# EAGLE design quadcopter (EAGLE 8.1.1)
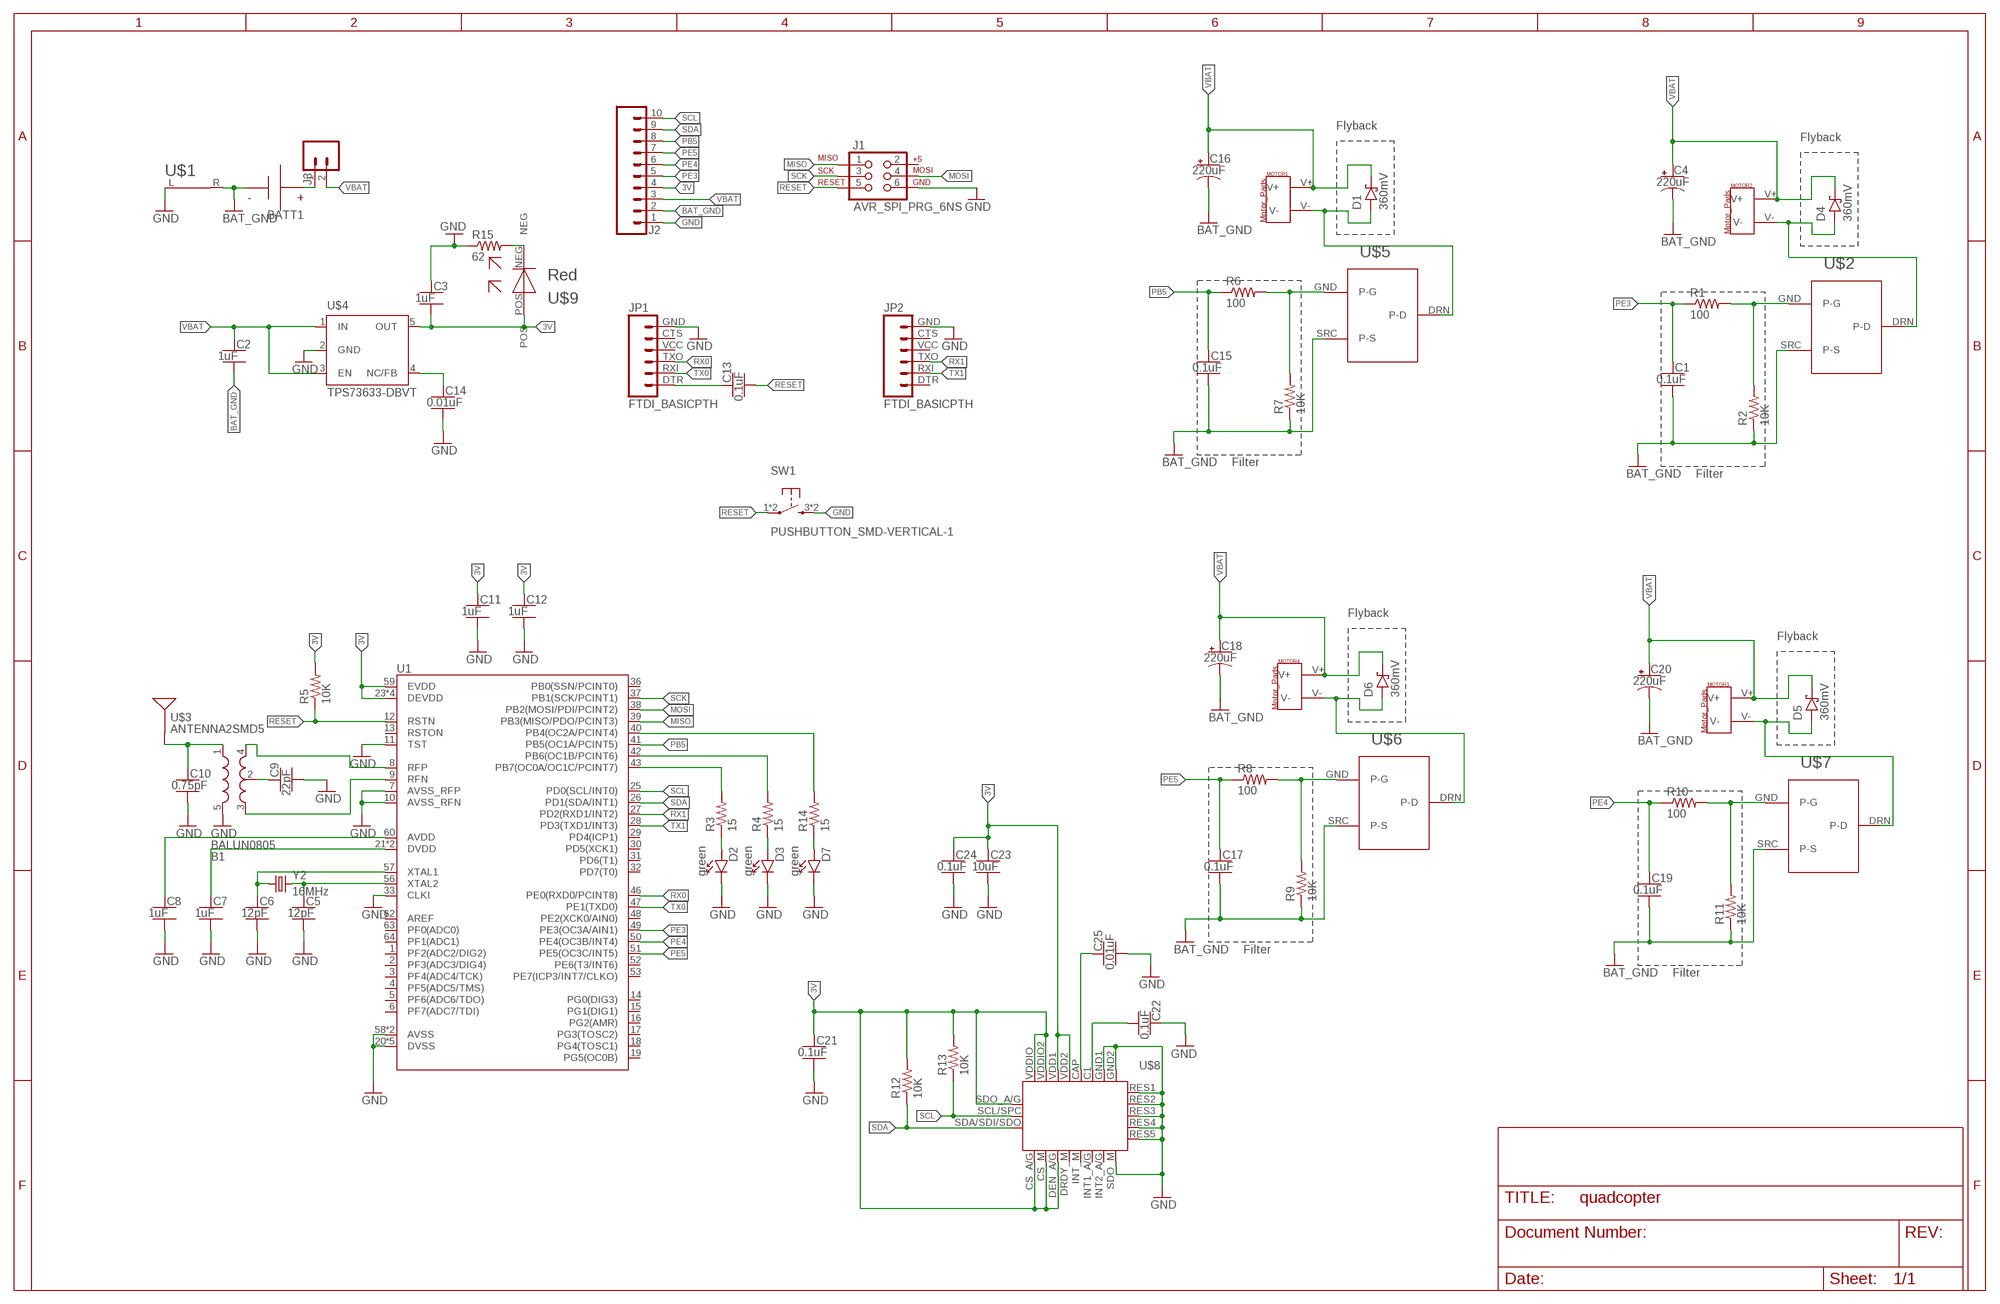
[diagram p0: schematic, sheet 1]

## Parts
B1  BALUN0805  [BALUN]
BATT1  BATTERY-HUBSAN-W/HOLDER  [BATTERY-W/HOLDER-380MAH-HUBSAN]
C1  0.1uF  CAPACITOR-NP_SMD-2012-0805_CERAMIC-0.1UF  [CAPC2012X140_HS]
C2  1uF  CAPACITOR-NP_SMD-2012-0805_CERAMIC-1UF  [CAPC2012X140_HS]
C3  1uF  CAPACITOR-NP_SMD-2012-0805_CERAMIC-1UF  [CAPC2012X140_HS]
C4  220uF  CAPACITOR-POL_SMD-7043-D_TANTALUM-220UF  [CAPMP7343X310_HS]
C5  12pF  CAPACITOR-NP_SMD-2012-0805_CERAMIC-12PF  [CAPC2012X140_HS]
C6  12pF  CAPACITOR-NP_SMD-2012-0805_CERAMIC-12PF  [CAPC2012X140_HS]
C7  1uF  CAPACITOR-NP_SMD-2012-0805_CERAMIC-1UF  [CAPC2012X140_HS]
C8  1uF  CAPACITOR-NP_SMD-2012-0805_CERAMIC-1UF  [CAPC2012X140_HS]
C9  22pF  CAPACITOR-NP_SMD-2012-0805_CERAMIC-22PF  [CAPC2012X140_HS]
C10  0.75pF  CAPACITOR-NP_SMD-2012-0805_CERAMIC-0.75PF  [CAPC2012X140_HS]
C11  1uF  CAPACITOR-NP_SMD-2012-0805_CERAMIC-1UF  [CAPC2012X140_HS]
C12  1uF  CAPACITOR-NP_SMD-2012-0805_CERAMIC-1UF  [CAPC2012X140_HS]
C13  0.1uF  CAPACITOR-NP_SMD-2012-0805_CERAMIC-0.1UF  [CAPC2012X140_HS]
C14  0.01uF  CAPACITOR-NP_SMD-2012-0805_CERAMIC-0.01UF  [CAPC2012X140_HS]
C15  0.1uF  CAPACITOR-NP_SMD-2012-0805_CERAMIC-0.1UF  [CAPC2012X140_HS]
C16  220uF  CAPACITOR-POL_SMD-7043-D_TANTALUM-220UF  [CAPMP7343X310_HS]
C17  0.1uF  CAPACITOR-NP_SMD-2012-0805_CERAMIC-0.1UF  [CAPC2012X140_HS]
C18  220uF  CAPACITOR-POL_SMD-7043-D_TANTALUM-220UF  [CAPMP7343X310_HS]
C19  0.1uF  CAPACITOR-NP_SMD-2012-0805_CERAMIC-0.1UF  [CAPC2012X140_HS]
C20  220uF  CAPACITOR-POL_SMD-7043-D_TANTALUM-220UF  [CAPMP7343X310_HS]
C21  0.1uF  CAPACITOR-NP_SMD-2012-0805_CERAMIC-0.1UF  [CAPC2012X140_HS]
C22  0.1uF  CAPACITOR-NP_SMD-2012-0805_CERAMIC-0.1UF  [CAPC2012X140_HS]
C23  10uF  CAPACITOR-NP_SMD-2012-0805_CERAMIC-10UF  [CAPC2012X140_HS]
C24  0.1uF  CAPACITOR-NP_SMD-2012-0805_CERAMIC-0.1UF  [CAPC2012X140_HS]
C25  0.01uF  CAPACITOR-NP_SMD-2012-0805_CERAMIC-0.01UF  [CAPC2012X140_HS]
D1  360mV  DIODE-SCHOTTKY_SMD-SOD123-360MV  [SOD3716X135_HS]
D2  green  DIODE-LED_SMD-2012-0805-GREEN  [LEDSC125X200X120-2_HS]
D3  green  DIODE-LED_SMD-2012-0805-GREEN  [LEDSC125X200X120-2_HS]
D4  360mV  DIODE-SCHOTTKY_SMD-SOD123-360MV  [SOD3716X135_HS]
D5  360mV  DIODE-SCHOTTKY_SMD-SOD123-360MV  [SOD3716X135_HS]
D6  360mV  DIODE-SCHOTTKY_SMD-SOD123-360MV  [SOD3716X135_HS]
D7  green  DIODE-LED_SMD-2012-0805-GREEN  [LEDSC125X200X120-2_HS]
J1  AVR_SPI_PRG_6NS  [2X3-NS]
J2  SIP-10_TH-254X10  [HDRV10W63P254_10X1_2540X254H838_HS]
J3  MALE_HEADER_2POS-2X1-0.1IN  [MALE_HEADER_2X1_0.1IN]
JP1  FTDI_BASICPTH  [FTDI_BASIC]
JP2  FTDI_BASICPTH  [FTDI_BASIC]
MOTOR1  MOTOR_PADS  [MOTOR_PADS]
MOTOR2  MOTOR_PADS  [MOTOR_PADS]
MOTOR3  MOTOR_PADS  [MOTOR_PADS]
MOTOR4  MOTOR_PADS  [MOTOR_PADS]
R1  100  RESISTOR_SMD-2012-0805-100  [RESC2012X60_HS]
R2  10K  RESISTOR_SMD-2012-0805-10K  [RESC2012X60_HS]
R3  15  RESISTOR_SMD-2012-0805-15  [RESC2012X60_HS]
R4  15  RESISTOR_SMD-2012-0805-15  [RESC2012X60_HS]
R5  10K  RESISTOR_SMD-2012-0805-10K  [RESC2012X60_HS]
R6  100  RESISTOR_SMD-2012-0805-100  [RESC2012X60_HS]
R7  10K  RESISTOR_SMD-2012-0805-10K  [RESC2012X60_HS]
R8  100  RESISTOR_SMD-2012-0805-100  [RESC2012X60_HS]
R9  10K  RESISTOR_SMD-2012-0805-10K  [RESC2012X60_HS]
R10  100  RESISTOR_SMD-2012-0805-100  [RESC2012X60_HS]
R11  10K  RESISTOR_SMD-2012-0805-10K  [RESC2012X60_HS]
R12  10K  RESISTOR_SMD-2012-0805-10K  [RESC2012X60_HS]
R13  10K  RESISTOR_SMD-2012-0805-10K  [RESC2012X60_HS]
R14  15  RESISTOR_SMD-2012-0805-15  [RESC2012X60_HS]
R15  62  RESISTOR_SMD-2012-0805-62  [RESC2012X60_HS]
SW1  PUSHBUTTON_SMD-VERTICAL-1  [TE_FSM8JSMA_HS]
U1  ATMEGA128RFA1  [QFN-64]
U$1  NET_BRIDGE  [NET_BRIDGE]
U$2  MOSFET_20V  [MOSFET_20V]
U$3  ANTENNA2SMD5  [ANTENNA-CHIP5]
U$4  TPS73633-DBVT  [SOT23-DBV]
U$5  MOSFET_20V  [MOSFET_20V]
U$6  MOSFET_20V  [MOSFET_20V]
U$7  MOSFET_20V  [MOSFET_20V]
U$8  IMU_9AXIS  [IMU_9AXIS]
U$9  Red  RED_LED_0805  [RED_LED_0805]
Y2  16MHz  CRYSTAL5X3  [CRYSTAL-SMD-5X3]

## Nets
3V: C3.2 C11.1 C12.1 C21.1 C23.1 C24.1 J2.4 R5.2 R12.2 R13.2 U1.23(DEVDD) U1.34(DEVDD) U1.44(DEVDD) U1.54(DEVDD) U1.59(EVDD) U$4.5(OUT) U$8.CS_A/G U$8.CS_M U$8.DEN_A/G U$8.SDO_A/G U$8.VDD1 U$8.VDD2 U$8.VDDIO2 U$8.VDDIO(VDDIO1) U$9.POS
BAT_GND [HIGHCURRENT]: BATT1.-(N) C1.2 C2.2 C4.2(-) C15.2 C16.2(-) C17.2 C18.2(-) C19.2 C20.2(-) J2.2 R2.1 R7.1 R9.1 R11.1 U$1.R U$2.SRC(P-S) U$5.SRC(P-S) U$6.SRC(P-S) U$7.SRC(P-S)
FILTERED1 [HIGHCURRENT]: R6.2 R7.2 U$5.GND(P-G)
FILTERED2 [HIGHCURRENT]: R1.2 R2.2 U$2.GND(P-G)
FILTERED3 [HIGHCURRENT]: R10.2 R11.2 U$7.GND(P-G)
FILTERED4 [HIGHCURRENT]: R8.2 R9.2 U$6.GND(P-G)
FLYBACK1 [HIGHCURRENT]: D1.A MOTOR1.V- U$5.DRN(P-D)
FLYBACK2 [HIGHCURRENT]: D4.A MOTOR2.V- U$2.DRN(P-D)
FLYBACK3 [HIGHCURRENT]: D5.A MOTOR3.V- U$7.DRN(P-D)
FLYBACK4 [HIGHCURRENT]: D6.A MOTOR4.V- U$6.DRN(P-D)
GND: B1.5(GND) C3.1 C5.2 C6.2 C7.2 C8.2 C9.2 C10.2 C11.2 C12.2 C14.2 C21.2 C22.1 C23.2 C24.2 C25.2 D2.C D3.C D7.C J1.6 J2.1 JP1.GND JP2.GND R15.1 SW1.3 SW1.4 U1.7(AVSS_RFP) U1.10(AVSS_RFN) U1.11(TST) U1.20(DVSS) U1.24(DVSS) U1.33(CLKI) U1.35(DVSS) U1.45(DVSS) U1.55(DVSS) U1.58(AVSS) U1.61(AVSS) U$1.L U$4.2(GND) U$8.GND1 U$8.GND2 U$8.RES1 U$8.RES2 U$8.RES3 U$8.RES4 U$8.RES5 U$8.SDO_M
MISO: J1.1 U1.39(PB3(MISO/PDO/PCINT3))
MOSI: J1.4 U1.38(PB2(MOSI/PDI/PCINT2))
N$1: C14.1 U$4.4(NC/FB)
N$2: D7.A R14.1
N$3: D2.A R3.1
N$4: C5.1 U1.56(XTAL2) Y2.3
N$5: C6.1 U1.57(XTAL1) Y2.1
N$6: D3.A R4.1
N$7: C7.1 U1.21(DVDD) U1.22(DVDD)
N$8: C8.1 U1.60(AVDD)
N$9: B1.4(OUT1) U1.8(RFP)
N$10: B1.3(OUT2) U1.9(RFN)
N$11: B1.2(GND) C9.1
N$12 [RFSIG]: B1.1(IN) C10.1 U$3.FEED(SIGNAL)
N$13: C13.1 JP1.DTR
N$17: BATT1.+(P) J3.1
N$18: R15.2 U$9.NEG
N$20: C25.1 U$8.CAP
N$23: C22.2 U$8.C1
PB4: R14.2 U1.40(PB4(OC2A/PCINT4))
PB5: C15.1 J2.8 R6.1 U1.41(PB5(OC1A/PCINT5))
PB6: R4.2 U1.42(PB6(OC1B/PCINT6))
PB7: R3.2 U1.43(PB7(OC0A/OC1C/PCINT7))
PE3: C1.1 J2.5 R1.1 U1.49(PE3(OC3A/AIN1))
PE4: C19.1 J2.6 R10.1 U1.50(PE4(OC3B/INT4))
PE5: C17.1 J2.7 R8.1 U1.51(PE5(OC3C/INT5))
RESET: C13.2 J1.5 R5.1 SW1.1 SW1.2 U1.12(RSTN)
RX0: JP1.TXO U1.46(PE0(RXD0/PCINT8))
RX1: JP2.TXO U1.27(PD2(RXD1/INT2))
SCK: J1.3 U1.37(PB1(SCK/PCINT1))
SCL: J2.10 R13.1 U1.25(PD0(SCL/INT0)) U$8.SCL/SPC
SDA: J2.9 R12.1 U1.26(PD1(SDA/INT1)) U$8.SDA/SDI/SDO
TX0: JP1.RXI U1.47(PE1(TXD0))
TX1: JP2.RXI U1.28(PD3(TXD1/INT3))
VBAT [HIGHCURRENT]: C2.1 C4.1(+) C16.1(+) C18.1(+) C20.1(+) D1.C D4.C D5.C D6.C J2.3 J3.2 MOTOR1.V+ MOTOR2.V+ MOTOR3.V+ MOTOR4.V+ U$4.1(IN) U$4.3(EN)
Unconnected: J1.2 JP1.CTS JP1.VCC JP2.CTS JP2.DTR JP2.VCC U1.1(PF2(ADC2/DIG2)) U1.2(PF3(ADC3/DIG4)) U1.3(PF4(ADC4/TCK)) U1.4(PF5(ADC5/TMS)) U1.5(PF6(ADC6/TDO)) U1.6(PF7(ADC7/TDI)) U1.13(RSTON) U1.14(PG0(DIG3)) U1.15(PG1(DIG1)) U1.16(PG2(AMR)) U1.17(PG3(TOSC2)) U1.18(PG4(TOSC1)) U1.19(PG5(OC0B)) U1.29(PD4(ICP1)) U1.30(PD5(XCK1)) U1.31(PD6(T1)) U1.32(PD7(T0)) U1.36(PB0(SSN/PCINT0)) U1.48(PE2(XCK0/AIN0)) U1.52(PE6(T3/INT6)) U1.53(PE7(ICP3/INT7/CLKO)) U1.62(AREF) U1.63(PF0(ADC0)) U1.64(PF1(ADC1)) U$8.DRDY_M U$8.INT1_A/G U$8.INT2_A/G U$8.INT_M

## Notes on the sheet
- Flyback
- Flyback
- Filter
- Filter
- Flyback
- Flyback
- Filter
- Filter

## Library data of the parts
B1 = quadparts_prebuilt:BALUN: 0805 footprint balun- Ember 351/357; DATASHEET: http://katalog.we-online.de/pbs/datasheet/748421245.pdf; DIST: Digikey; DISTPN: 732-2230-6-ND; MFR: Wurth Electronics Inc; MPN: 748421245; PRICE: 2.63
BATT1 = quadparts_prebuilt:BATTERY; CREATOR: Swanson; DIST: AMAZON; DISTPN: http://www.amazon.com/dp/B00RROB6Q4?smid=AMNTPWSAB5H0S; MFR: HUBSAN; MPN: X4-H107C-8-in-1
C1 C13 C15 C17 C19 C21 C22 C24 = quadparts_prebuilt:CAPACITOR-NP_: Nonpolarized capacitor; DIST: Digikey; DISTPN: 490-1666-1-ND; MFR: Murata Electronics North America; MPN: GRM21BR71H104KA01L
C2 C3 C7 C8 C11 C12 = quadparts_prebuilt:CAPACITOR-NP_: Nonpolarized capacitor; DIST: Digikey; DISTPN: 490-4736-1-ND; MFR: Murata Electronics North America; MPN: GRM21BR71H105KA12L
C4 C16 C18 C20 = quadparts_prebuilt:CAPACITOR-POL_: Polarized capacitor; DIST: Digikey; DISTPN: 478-8912-1-ND; MFR: AVX Corporation; MPN: TAJD227K006RNJ
C5 C6 = quadparts_prebuilt:CAPACITOR-NP_: Nonpolarized capacitor; DIST: Digikey; DISTPN: 490-5531-1-ND; MFR: Murata Electronics North America; MPN: GRM21A5C2E120JW01D
C9 = quadparts_prebuilt:CAPACITOR-NP_: Nonpolarized capacitor; DIST: Digikey; DISTPN: 490-5534-1-ND; MFR: Murata Electronics North America; MPN: GRM21A5C2E220JW01D
C10 = quadparts_prebuilt:CAPACITOR-NP_: Nonpolarized capacitor; DIST: Digikey; DISTPN: 490-3585-1-ND; MFR: Murata Electronics North America; MPN: GQM2195C2AR75CB01D
C14 C25 = quadparts_prebuilt:CAPACITOR-NP_: Nonpolarized capacitor; DIST: Digikey; DISTPN: 490-8295-1-ND; MFR: Murata Electronics North America; MPN: GRM2195C1H103FA01D
C23 = quadparts_prebuilt:CAPACITOR-NP_: Nonpolarized capacitor; DIST: Digikey; DISTPN: 490-5523-1-ND; MFR: Murata Electronics North America; MPN: GRM21BR61E106KA73L
D1 D4-D6 = quadparts_prebuilt:DIODE-SCHOTTKY_: Schottky diode; DIST: Digikey; DISTPN: CRS08QMCT-ND; MFR: Toshiba Semiconductor and Storage; MPN: CRS08(TE85L,Q,M)
D2 D3 D7 = quadparts_prebuilt:DIODE-LED_: Light emitting diode; DIST: Digikey; DISTPN: 160-1179-1-ND; MFR: Lite-On Inc; MPN: LTST-C170GKT
J1 = quadparts_prebuilt:AVR_SPI_PRG_6: AVR ISP 6 Pin This is the reduced ISP connector for AVR programming. Common on Arduino. This footprint will take up less PCB space and can be used with a 10-pin to 6-pin adapter such as SKU: BOB-08508; DATASHEET: http://portal.fciconnect.com/Comergent//fci/drawing/67996.pdf; DIST: Digikey; DISTPN: 609-3234-ND; MFR: Amphenol FCI; MPN: 67997-206HLF; PRICE: 0.31
J2 = quadparts_prebuilt:SIP-10_: 10 pin single inline pin header, socket, or connector; DATASHEET: http://portal.fciconnect.com/Comergent//fci/drawing/68000.pdf; DIST: Digikey; DISTPN: 609-3250-ND; MFR: Amphenol FCI; MPN: 68000-110HLF; PRICE: 0.55
J3 = quadparts:MALE_HEADER_2POS: 2 pin single inline pin header, socket, or connector; CREATOR: SWANSON; DIST: Digikey; DISTPN: 3M9447-ND; MFR: 3M; MPN: 961102-6404-AR; REVIEWER: John Wu
JP1 JP2 = quadparts_prebuilt:FTDI_BASIC: FTDI Basic header with labels; DATASHEET: http://portal.fciconnect.com/Comergent//fci/drawing/68015.pdf; DIST: Digikey; DISTPN: 609-3327-ND; MFR: Amphenol FCI; MPN: 68016-406HLF; PRICE: 0.33
MOTOR1-MOTOR4 = quadparts_prebuilt:MOTOR_PADS; DIST: NA; DISTPN: NA; MFR: NA; MPN: NA
R1 R6 R8 R10 = quadparts_prebuilt:RESISTOR_: Resistor; DIST: Digikey; DISTPN: 311-100ARCT-ND; MFR: Yageo; MPN: RC0805JR-07100RL
R2 R5 R7 R9 R11-R13 = quadparts_prebuilt:RESISTOR_: Resistor; DIST: Digikey; DISTPN: 311-10KARCT-ND; MFR: Yageo; MPN: RC0805JR-0710KL
R3 R4 R14 = quadparts_prebuilt:RESISTOR_: Resistor; CREATOR: Joshua Crook; DIST: Digikey; DISTPN: 311-15ARCT-ND; MFR: Yageo; MPN: RC0805JR-0715RL; REVIEWER: John Wu
R15 = quadparts_prebuilt:RESISTOR_: Resistor; CREATOR: Joshua Crook; DIST: Digikey; DISTPN: 311-62ARCT-ND; MFR: Yageo; MPN: RC0805JR-0762RL; REVIEWER: John Wu
SW1 = quadparts_prebuilt:PUSHBUTTON_: Pushbutton with 2 pins shorting 1 to 2 and two extra mounting pins 3 & 4; DIST: Digikey; DISTPN: 450-1129-ND; MFR: TE Connectivity Alcoswitch Switches; MPN: FSM4JSMA
U1 = quadparts_prebuilt:ATMEGA128RFA1: ATmega128RFA1 8-bit AVR Microcontroller with Low Power 2.4GHz Transceiver for ZigBee and IEEE 802.15.4; CREATOR: Swanson; DATASHEET: http://www.atmel.com/Images/Atmel-8266-MCU_Wireless-ATmega128RFA1_Datasheet.pdf; DIST: Digikey; DISTPN: ATMEGA128RFA1-ZUR00DKR-ND; MFR: Atmel; MPN: ATMEGA128RFA1-ZUR00; PRICE: 10.21
U$1 = quadparts:NET_BRIDGE; CREATOR: Joshua Crook; REVIEWER: John Wu
U$2 U$5-U$7 = quadparts:MOSFET_20V; CREATOR: Alexander Orr; DIST: Digikey; DISTPN: SI2302CDS-T1-E3CT-ND; MFR: Vishay Siliconix; MPN: SI2302CDS-T1-E3; REVIEWER: John Wu
U$3 = quadparts_prebuilt:ANTENNA2: Chip antenna Single endded antenna. Common with smaller chip antennas. CHIP4 package is the GPS Chip Antenna SKU: GPS-08418. CHIP5 package is 2.4GHz chip antenna SKU: WRL-00144.; DATASHEET: http://www.linxtechnologies.com/resources/data-guides/ant-xxx-chp-x.pdf; DIST: Digikey; DISTPN: ANT-2.45-CHPCT-ND; MFR: Linx Technologies Inc.; MPN: ANT-2.45-CHP-T; PRICE: 3.16
U$4 = quadparts_prebuilt:TPS73633-DBVT; DATASHEET: http://www.ti.com/lit/ds/symlink/lp3985.pdf; DIST: Digikey; DISTPN: LP3985IM5X-3.0/NOPBCT-ND; MFR: Texas Instruments; MPN: LP3985IM5X-3.0/NOPB; PRICE: 0.59
U$8 = quadparts:IMU_9AXIS; CREATOR: Alex Orr; DIST: Digikey; DISTPN: 497-14946-1-ND; MFR: STMicroelectronics; MPN: LSM9DS1TR; REVIEWER: John Wu
U$9 = LEDs:RED_LED_0805; CREATOR: Alexander Orr; DIST: Digikey; DISTPN: 475-1278-1-ND; MFR: OSRAM Opto Semiconductors Inc.; MPN: LS R976-NR-1; REVIEWER: John Wu
Y2 = quadparts_prebuilt:CRYSTAL: Various standard crystals. Proven footprints.; DATASHEET: http://www.abracon.com/Resonators/abm3b.pdf; DIST: Digikey; DISTPN: 535-9122-1-ND; MFR: Abracon LLC; MPN: ABM3B-16.000MHZ-B2-T; PRICE: 0.68; PROD_ID: XTAL-08218

## Net classes
1 RFSIG: width 0.457 mm
2 HIGHCURRENT: width 0.457 mm

## Board
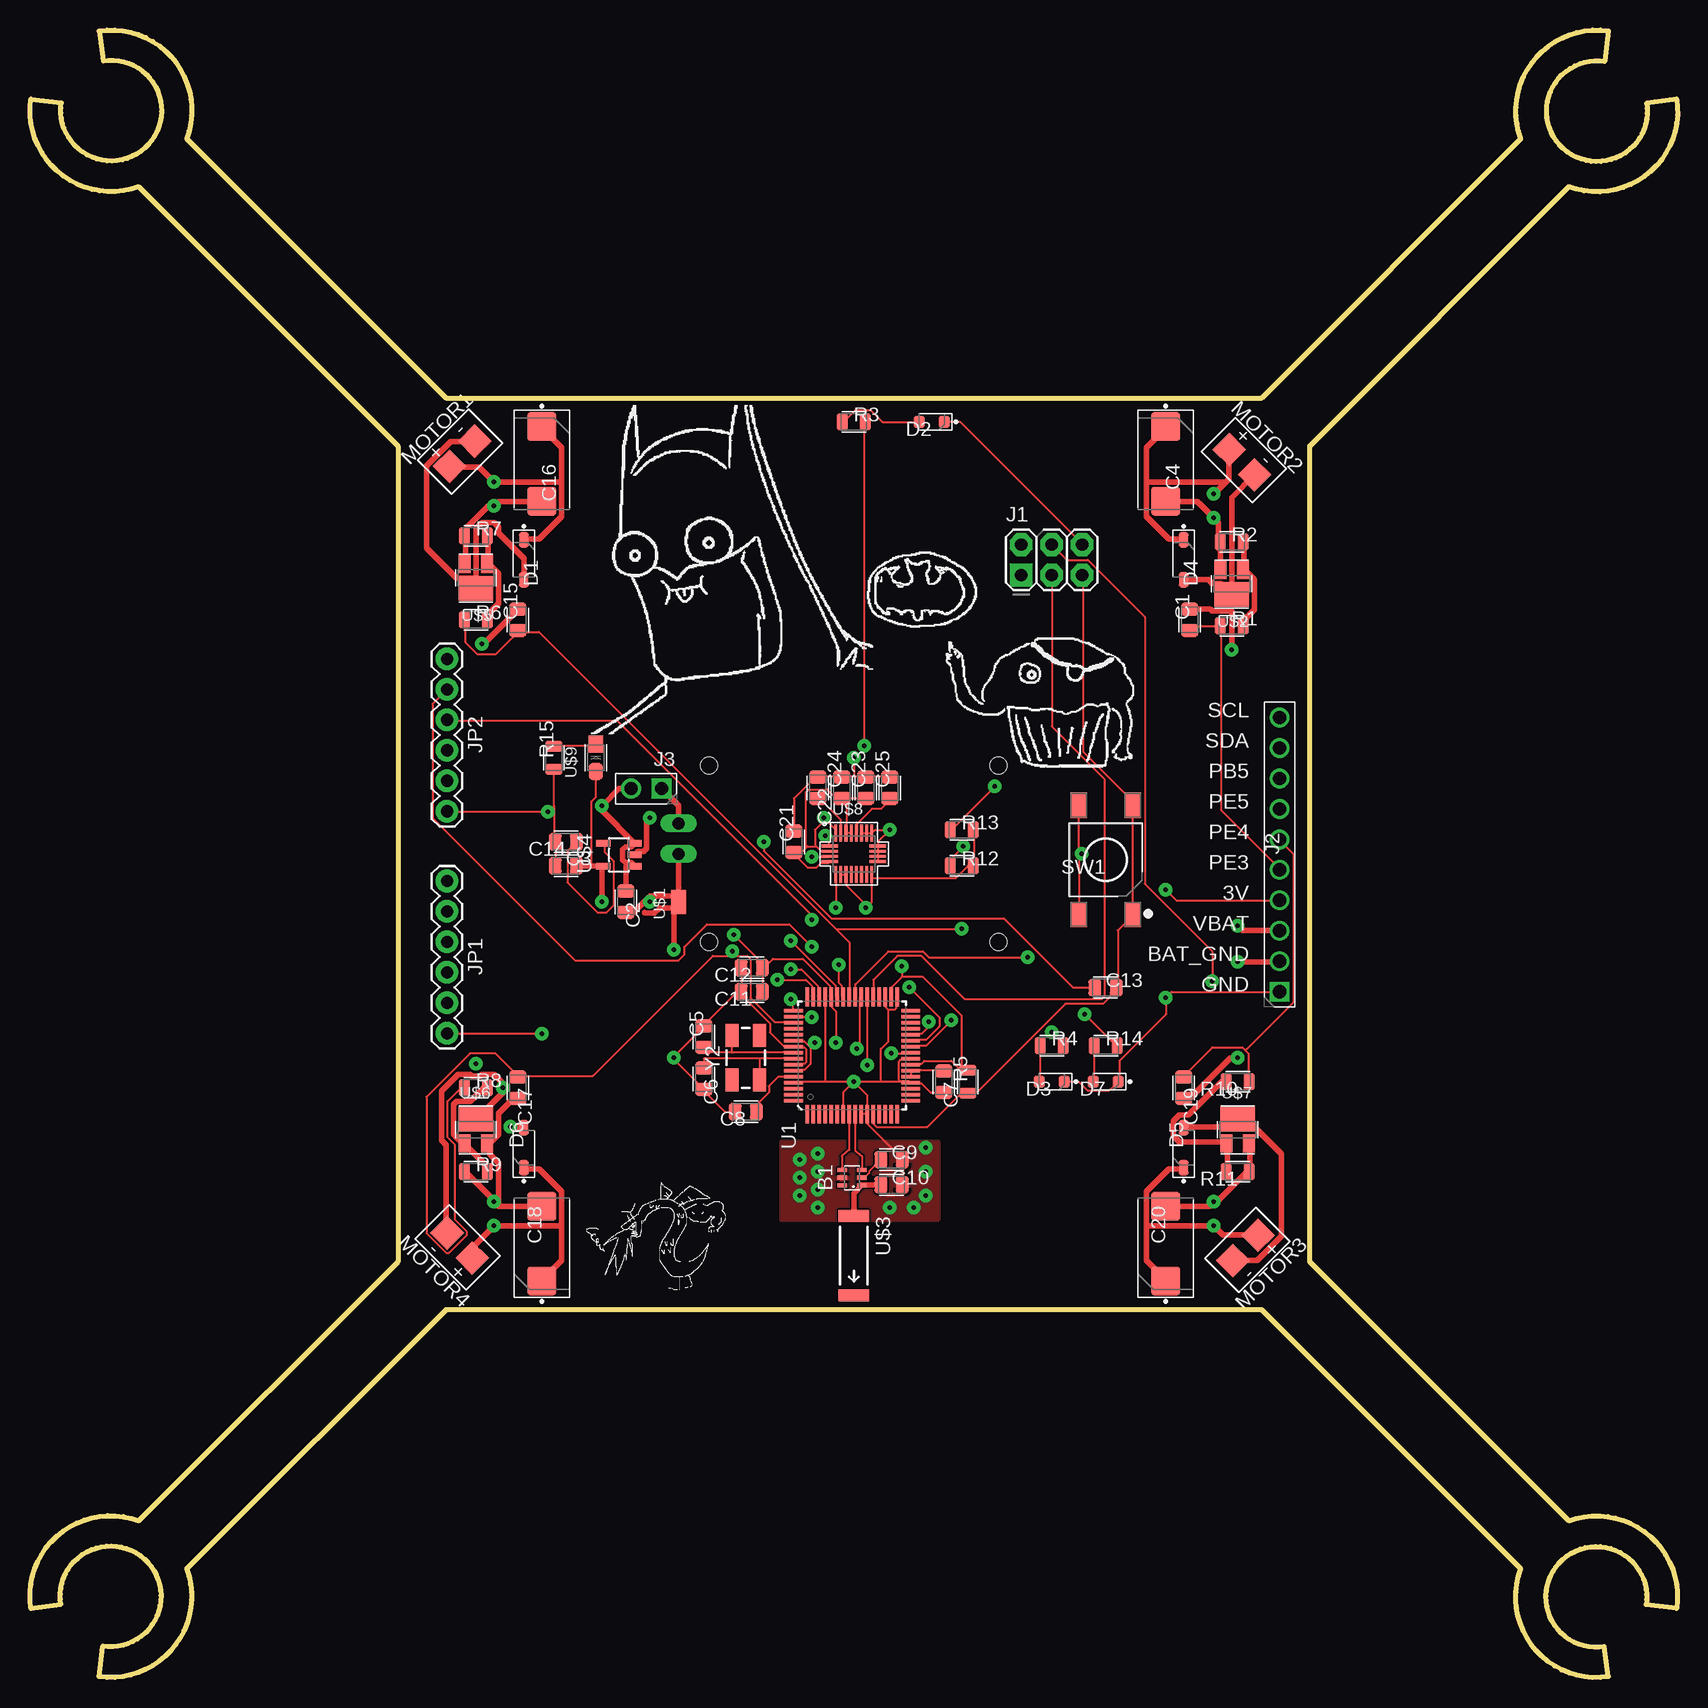
[diagram p1: board, top side]
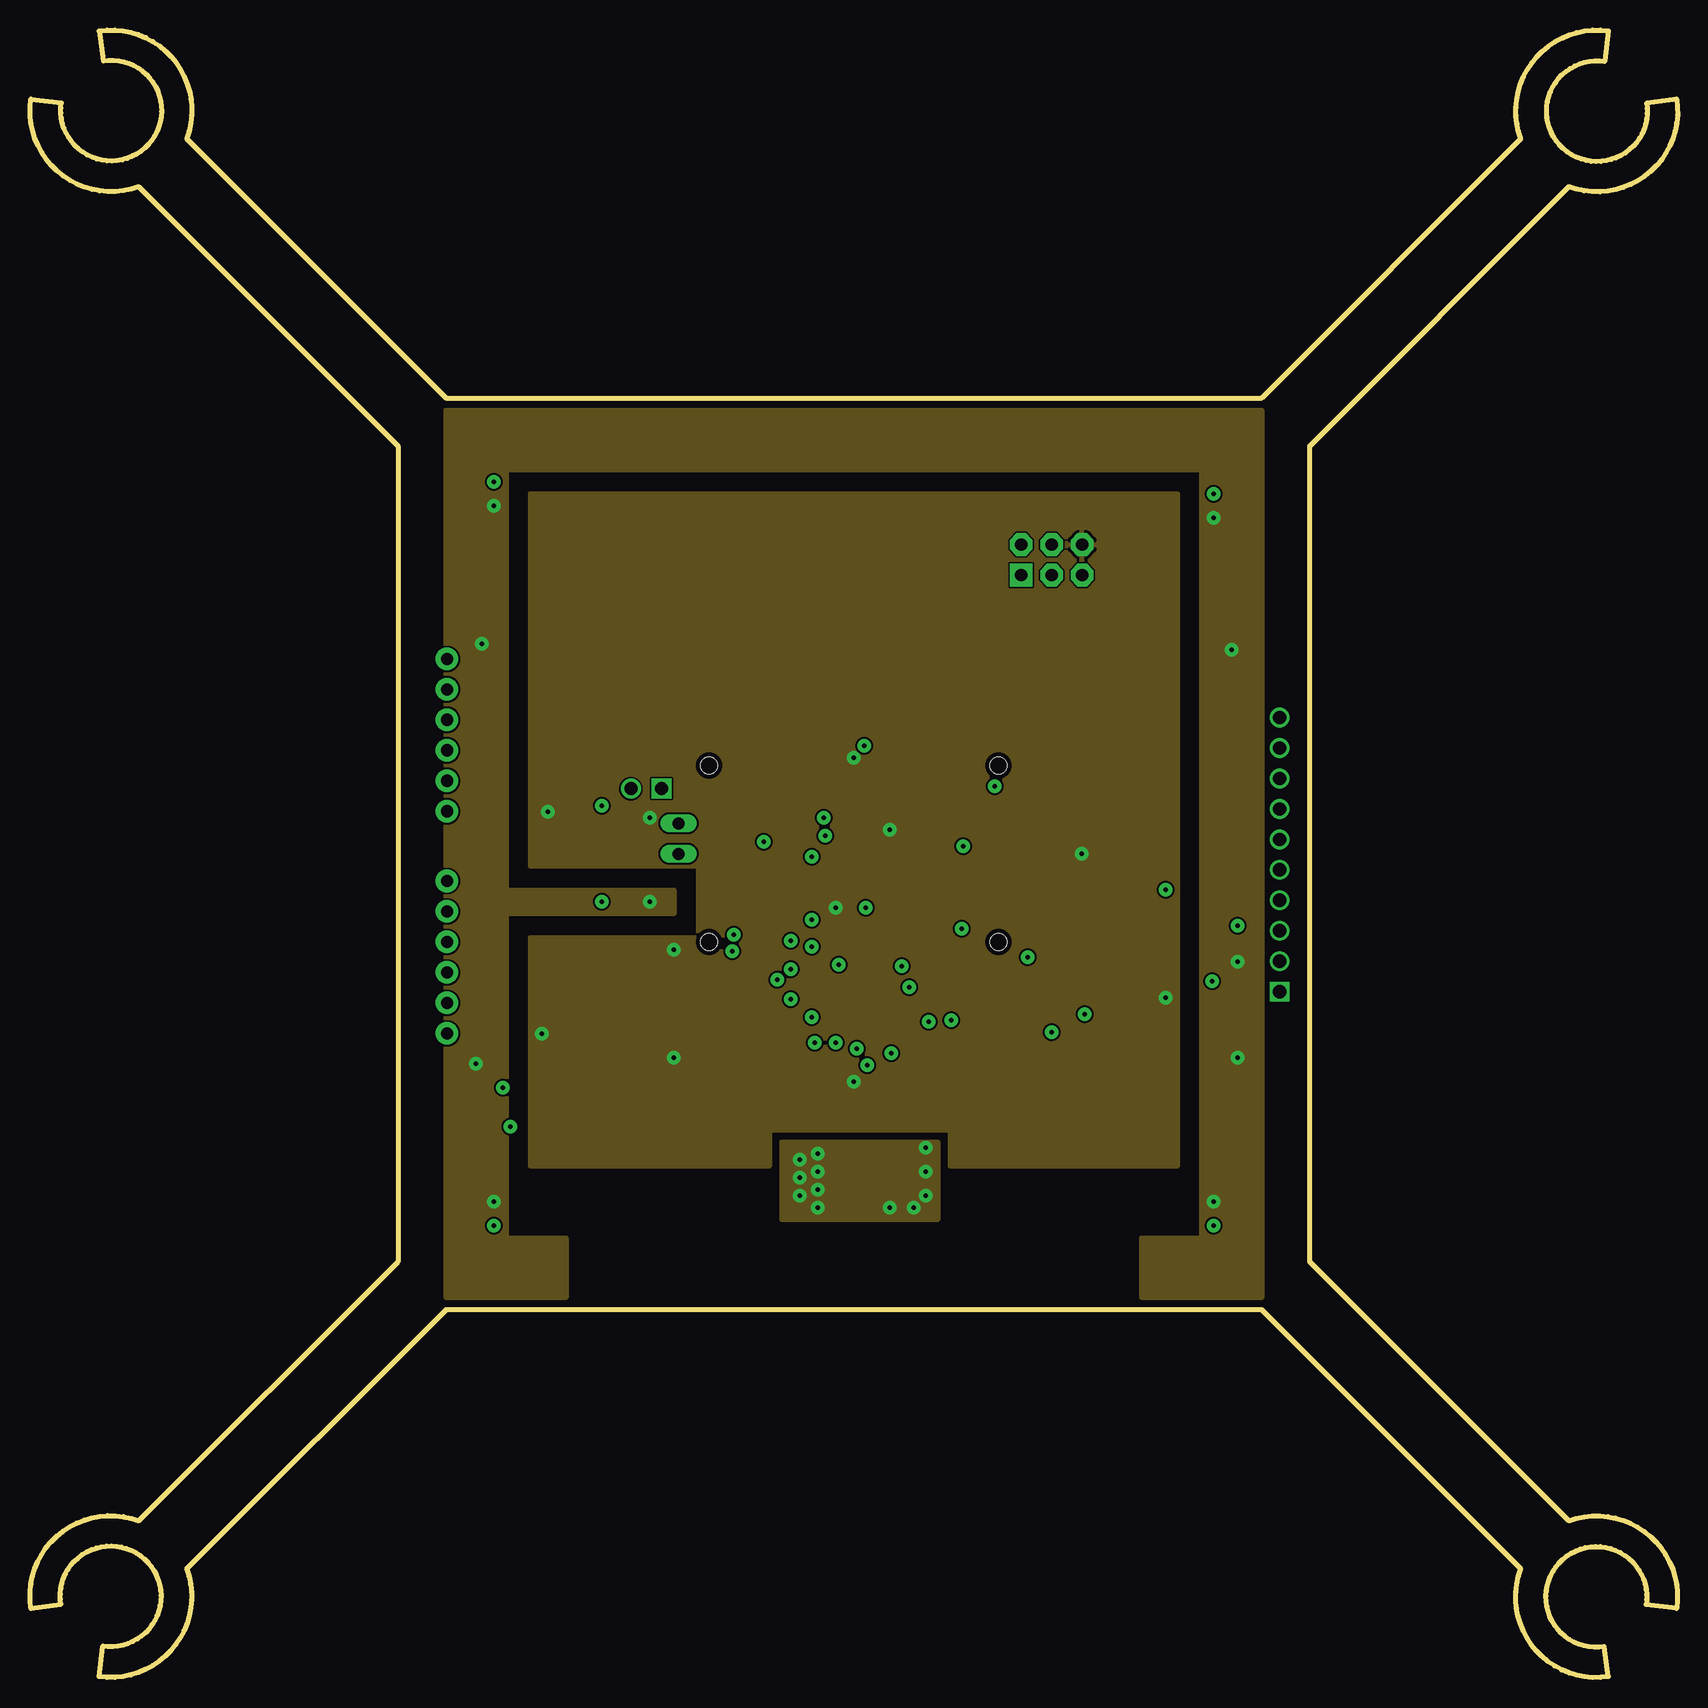
[diagram p2: board, inner layer Route2]
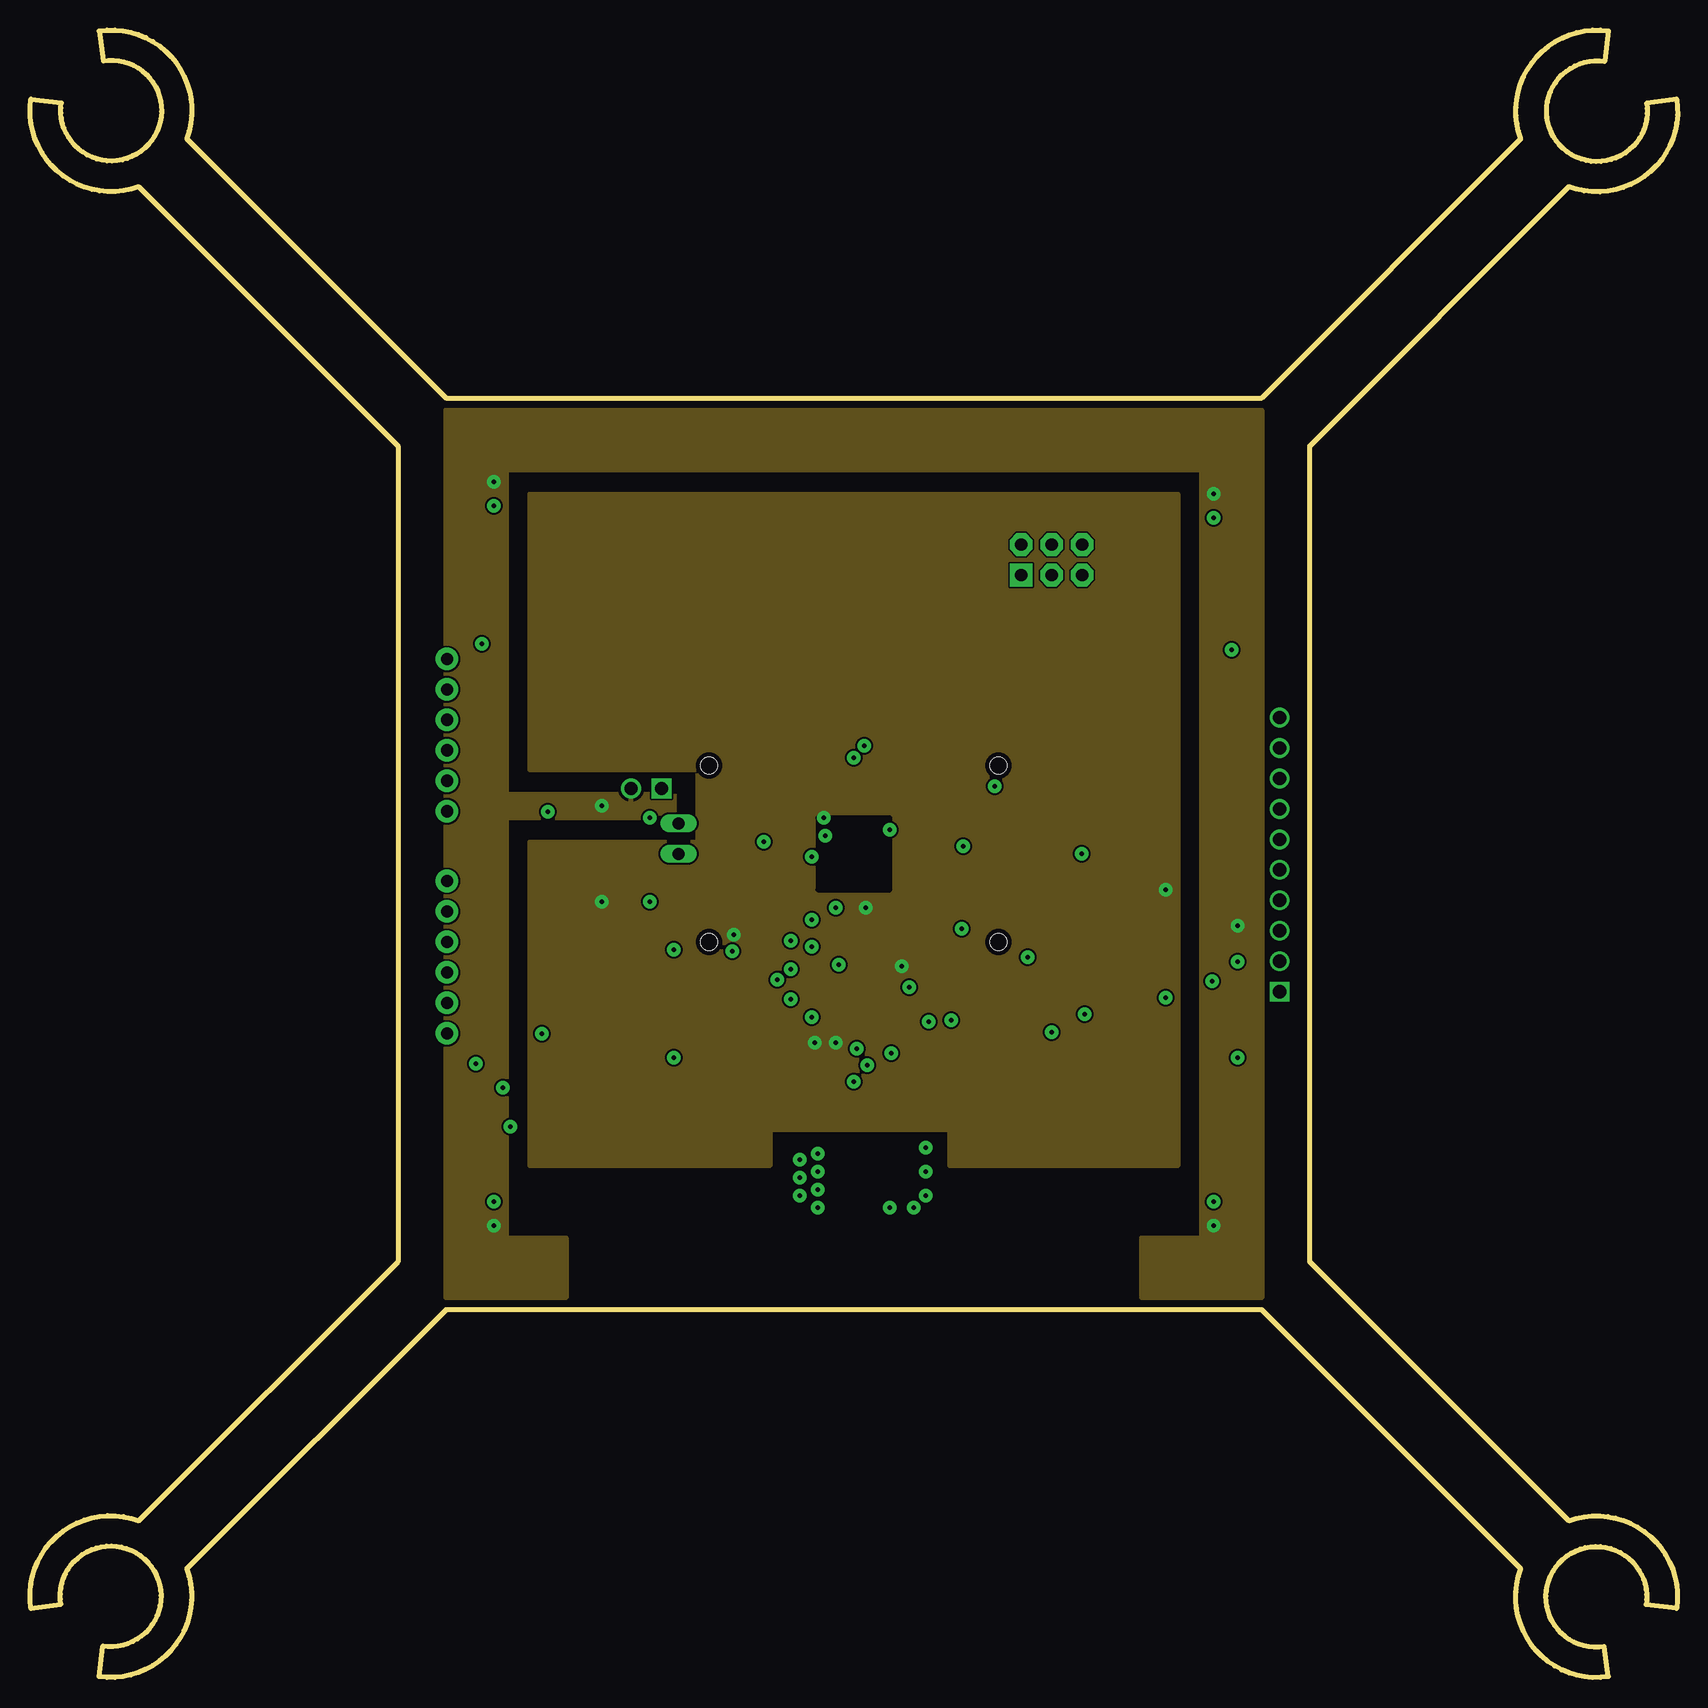
[diagram p3: board, inner layer Route15]
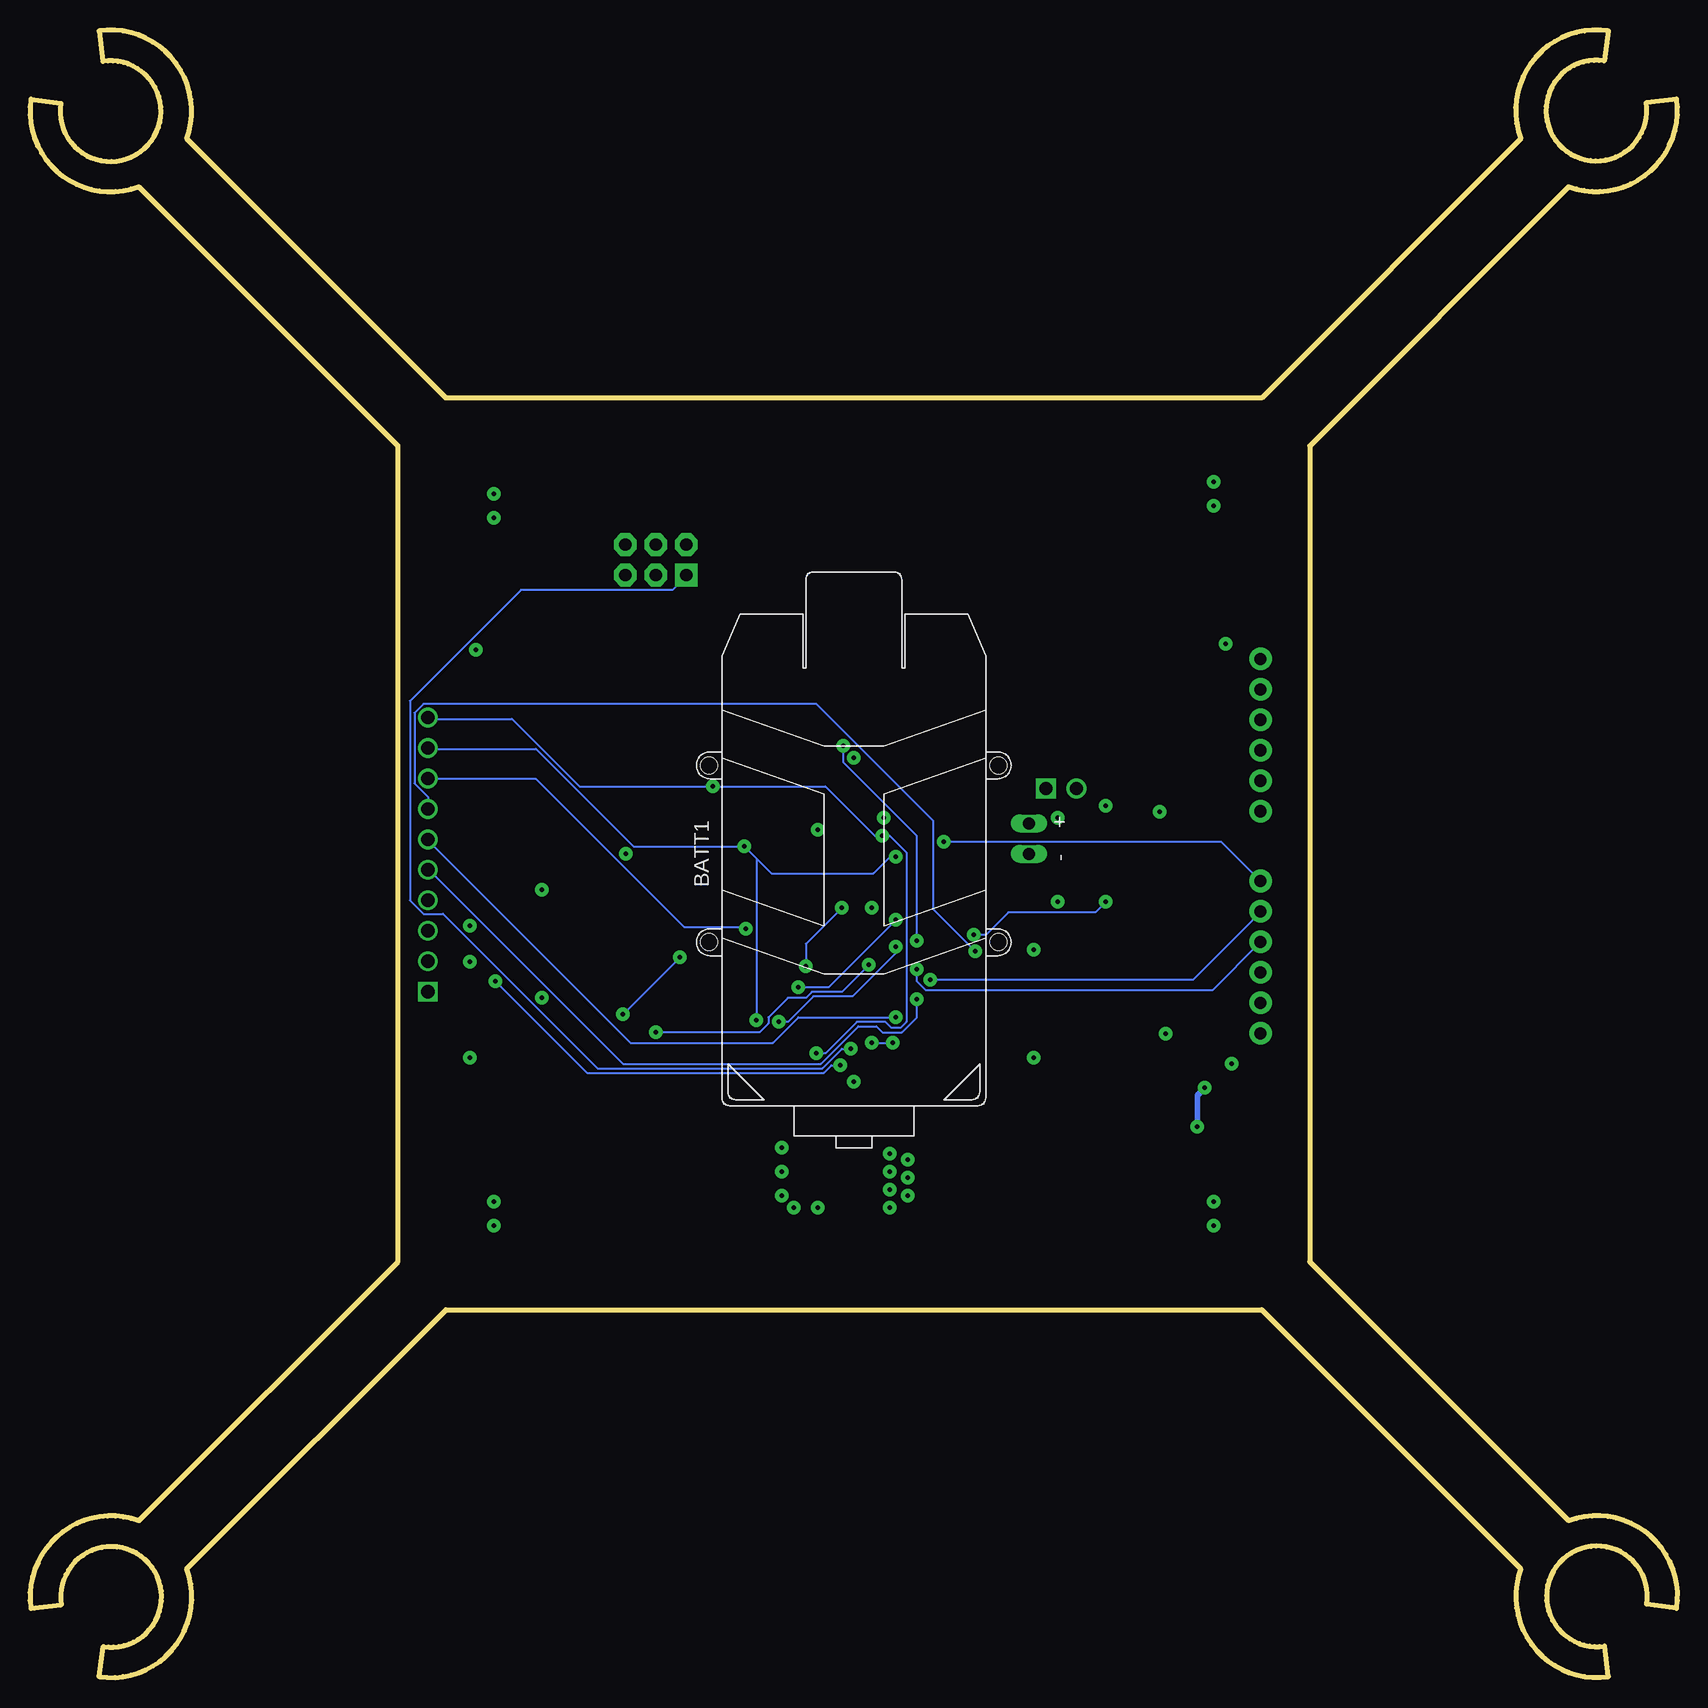
[diagram p4: board, bottom side, seen from below]

Size 137.33 x 137.33 mm. Coordinates in mm from the lower left corner, seen from the top.
Outline: 9.07,124.27 30.67,102.67 30.67,34.67 9.07,13.07 arc119 0.07,5.77 2.57,6.12 arc-288 6.07,2.62 5.77,0.07 arc118 13.07,9.07 34.67,30.67 102.67,30.67 124.27,9.07 arc119 131.57,0.07 131.22,2.57 arc-288 134.72,6.07 137.27,5.77 arc118 128.27,13.07 106.67,34.67 106.67,102.67 128.27,124.27 arc119 137.27,131.57 134.77,131.22 arc-288 131.27,134.72 131.57,137.27 arc118 124.27,128.27 102.67,106.67 34.67,106.67 13.07,128.27 arc119 5.77,137.27 6.12,134.77 arc-288 2.62,131.27 0.07,131.57 arc118 9.07,124.27
Copper layers (1*2*15*16): Top 0.035559375mm / dielectric 1.501140625mm / Route2 0.035559375mm / dielectric 0.149859375mm / Route15 0.035559375mm / dielectric 0.200659375mm / Bottom 0.035559375mm
Design rules "batman-4pcb-66board": minimum track width 6mil, minimum drill 15mil, track to track 6mil, track to pad 6mil, pad to pad 6mil, via to via 6mil, smd to smd 6mil, copper to edge 15mil, drill to drill 10mil, minimum pad ring 10mil, minimum via ring 15mil, stop-mask expansion 4mil, vias tented up to drill 0mil, thermal gap 10mil
tRestrict: area 67.2,67.4 to 70.2,69.9; area 59.7,30.7 to 78.7,45.7
bRestrict: area 67.2,67.4 to 70.2,69.9; area 59.7,30.7 to 78.7,45.7

### Footprints (pad centres in the part's own frame; a part is rotated, then mirrored left to right if it is on the bottom)
BALUN = smd 0.35 x 0.8: 1 -0.65,-0.8; 2 0,-0.8; 3 0.65,-0.8; 4 0.65,0.8; 5 0,0.8; 6 -0.65,0.8
BATTERY-W/HOLDER-380MAH-HUBSAN = drill 1 long: + -2.54,14.605; - 0,14.605 | hole 1.4: -7.35,-12.05; -7.35,12.05; 7.35,-12.05; 7.35,12.05
CAPC2012X140_HS = smd 1.08 x 1.42: 1 -0.895,0; 2 0.895,0
CAPMP7343X310_HS = smd 2.37 x 2.43: 1 -3.12,0; 2 3.12,0
SOD3716X135_HS = smd 1.25 x 0.8: A 1.665,0; C -1.665,0
LEDSC125X200X120-2_HS = smd 0.94 x 0.99: A 1.045,0; C -1.045,0
2X3-NS = drill 1.016 pad 1.88 square: 1 -2.54,-1.27 | drill 1.016 pad 1.88 octagon: 2 -2.54,1.27; 3 0,-1.27; 4 0,1.27; 5 2.54,-1.27; 6 2.54,1.27
HDRV10W63P254_10X1_2540X254H838_HS = drill 1.1 pad 1.65 square: 1 0,0 | drill 1.1 pad 1.65: 2 2.54,0; 3 5.08,0; 4 7.62,0; 5 10.16,0; 6 12.7,0; 7 15.24,0; 8 17.78,0; 9 20.32,0; 10 22.86,0
MALE_HEADER_2X1_0.1IN = drill 1.1 pad 1.65 square: 1 0,0 | drill 1.1 pad 1.65: 2 2.54,0
FTDI_BASIC = drill 1.016 pad 1.88: CTS 10.16,0; DTR 0,0; GND 12.7,0; RXI 2.54,0; TXO 5.08,0; VCC 7.62,0
MOTOR_PADS = smd 2 x 2: V+ -1,0; V- 2,0
RESC2012X60_HS = smd 0.92 x 1.38: 1 -0.955,0; 2 0.955,0
TE_FSM8JSMA_HS = smd 1.4 x 2.1: 1 -2.25,4.55; 2 -2.25,-4.55; 3 2.25,4.55; 4 2.25,-4.55
QFN-64 = smd 1.562 x 0.28: 1 -4.881,3.75; 2 -4.881,3.25; 3 -4.881,2.75; 4 -4.881,2.25; 5 -4.881,1.75; 6 -4.881,1.25; 7 -4.881,0.75; 8 -4.881,0.25; 9 -4.881,-0.25; 10 -4.881,-0.75; 11 -4.881,-1.25; 12 -4.881,-1.75; 13 -4.881,-2.25; 14 -4.881,-2.75; 15 -4.881,-3.25; 16 -4.881,-3.75; 33 4.881,-3.75; 34 4.881,-3.25; 35 4.881,-2.75; 36 4.881,-2.25; 37 4.881,-1.75; 38 4.881,-1.25; 39 4.881,-0.75; 40 4.881,-0.25; 41 4.881,0.25; 42 4.881,0.75; 43 4.881,1.25; 44 4.881,1.75; 45 4.881,2.25; 46 4.881,2.75; 47 4.881,3.25; 48 4.881,3.75 | smd 0.28 x 1.562: 17 -3.75,-4.881; 18 -3.25,-4.881; 19 -2.75,-4.881; 20 -2.25,-4.881; 21 -1.75,-4.881; 22 -1.25,-4.881; 23 -0.75,-4.881; 24 -0.25,-4.881; 25 0.25,-4.881; 26 0.75,-4.881; 27 1.25,-4.881; 28 1.75,-4.881; 29 2.25,-4.881; 30 2.75,-4.881; 31 3.25,-4.881; 32 3.75,-4.881; 49 3.75,4.881; 50 3.25,4.881; 51 2.75,4.881; 52 2.25,4.881; 53 1.75,4.881; 54 1.25,4.881; 55 0.75,4.881; 56 0.25,4.881; 57 -0.25,4.881; 58 -0.75,4.881; 59 -1.25,4.881; 60 -1.75,4.881; 61 -2.25,4.881; 62 -2.75,4.881; 63 -3.25,4.881; 64 -3.75,4.881
NET_BRIDGE = smd 1 x 1.25: L 0,0; R 1,0
MOSFET_20V = smd 2.9 x 2.05: DRN 0,0.875 | smd 1 x 1.5: GND -0.95,-1.15; SRC 0.95,-1.15
ANTENNA-CHIP5 = smd 1.016 x 2.54: FEED -3.302,0; NC 3.302,0
SOT23-DBV = smd 0.55 x 1.2: 1 -0.95,-1.3; 2 0,-1.3; 3 0.95,-1.3; 4 0.95,1.3; 5 -0.95,1.3
IMU_9AXIS = smd 0.224 x 1.4: C1 -1.075,1.725; CAP 0.215,1.725; CS_A/G -1.075,-1.725; CS_M -0.645,-1.725; DEN_A/G 1.505,-1.725; DRDY_M -0.215,-1.725; GND1 0.645,1.725; GND2 1.075,1.725; INT1_A/G 0.645,-1.725; INT2_A/G 1.075,-1.725; INT_M 0.215,-1.725; SDO_M -1.505,-1.725; VDD1 -0.645,1.725; VDD2 -0.215,1.725; VDDIO -1.505,1.725 | smd 0.225 x 1.4: RES1 1.505,1.725 | smd 1.4 x 0.225: RES2 2.005,0.645; RES3 2.005,0.215; RES4 2.005,-0.215; RES5 2.005,-0.645 | smd 1.4 x 0.224: SCL/SPC -2.005,0.645; SDA/SDI/SDO -2.005,-0.215; SDO_A/G -2.005,-0.645; VDDIO2 -2.005,0.215
RED_LED_0805 = smd 1.4 x 1.2: NEG 1.15,0; POS -1.15,0
CRYSTAL-SMD-5X3 = smd 1.9 x 1.1: 1 -1.85,-1.15; 2 1.85,-1.15; 3 1.85,1.15; 4 -1.85,1.15

### Placement (x,y rotation side)
B1  68.52,41.67 90 top
BATT1  68.67,68.67 270 bottom
C1  96.67,88.17 90 top
C2  49.67,64.67 270 top
C3  44.67,67.67 0 top
C4  94.67,101.17 270 top
C5  56.17,53.42 90 top
C6  56.17,49.92 270 top
C7  76.17,49.67 270 top
C8  59.67,47.17 180 top
C9  71.82,43.17 0 top
C10  71.82,41.07 0 top
C11  60.17,57.17 180 top
C12  60.17,59.17 180 top
C13  89.66,57.52 0 top
C14  44.67,69.67 180 top
C15  40.67,88.17 90 top
C16  42.67,101.17 270 top
C17  40.67,49.17 270 top
C18  42.67,36.17 90 top
C19  96.17,49.17 270 top
C20  94.67,36.17 90 top
C21  63.67,69.67 90 top
C22  65.67,74.17 270 top
C23  69.67,74.17 90 top
C24  67.67,74.17 90 top
C25  71.67,74.17 90 top
D1  41.17,93.17 270 top
D2  75.17,104.67 180 top
D3  85.17,49.67 180 top
D4  96.17,93.17 270 top
D5  96.17,44.17 90 top
D6  41.17,44.17 90 top
D7  89.67,49.67 180 top
J1  85.17,93.17 0 top
J2  104.17,57.17 90 top
J3  52.64,74.1 180 top
JP1  34.77,66.4 270 top
JP2  34.77,84.91 270 top
MOTOR1  35.67,101.67 45 top
MOTOR2  100.67,101.67 315 top
MOTOR3  101.67,36.17 225 top
MOTOR4  36.17,35.67 135 top
R1  100.17,87.67 0 top
R2  100.17,94.67 0 top
R3  68.67,104.67 0 top
R4  85.17,52.67 0 top
R5  78.17,49.67 90 top
R6  37.17,88.17 0 top
R7  37.17,95.17 0 top
R8  37.17,49.17 0 top
R9  37.17,42.17 0 top
R10  100.67,49.67 180 top
R11  100.67,42.17 180 top
R12  77.67,67.67 0 top
R13  77.67,70.67 0 top
R14  89.67,52.67 0 top
R15  43.67,76.67 90 top
SW1  89.67,68.17 180 top
U1  68.53,51.85 90 top
U$1  54.07,64.17 90 top
U$2  100.17,91.17 180 top
U$3  68.67,35.17 270 top
U$4  49.1,68.58 90 top
U$5  37.17,91.67 180 top
U$6  37.17,45.67 0 top
U$7  100.67,45.67 0 top
U$8  68.67,68.67 0 top
U$9  47.17,76.67 90 top
U$10  [DERPY_BATMAN]  46.67,78.67 0 top
U$11  [MUFFIN_MAN]  69.67,75.67 0 top
U$12  [TROGDOR]  45.67,27.67 0 top
Y2  59.67,51.67 90 top

### Tracks (layer width: path | path; a pad name or v marks a point on that pad's centre or on a via)
3V  (via drill 0.38)
  Top 0.152: 65.04,52.54 65.04,51.17 64.54,50.67 63.67,50.67 U1.59 | 65.04,52.54 64.54,53.04 63.67,53.04 U1.54 | C11.1 61.04,57.17 61.04,59.17 C12.1 | 61.29,59.29 61.17,59.17 C12.1 | 61.29,59.29 61.92,59.92 64.42,59.92 66.67,57.67 66.67,56.79 U1.44 66.79,56.67 66.79,55.92 67.17,55.54 v67.17,52.92 | v65.42,52.92 65.04,52.54 | 77.67,50.67 77.54,50.67 76.79,51.42 74.54,51.42 74.29,51.17 73.42,51.17 U1.23 | 77.67,50.67 78.17,50.67 R5.2 77.67,50.67 | 72.67,58.42 71.79,57.54 71.79,56.79 U1.34 | 72.67,58.42 74.42,58.42 77.67,55.17 77.67,50.67 | 68.04,70.42 68.42,70.42 U$8.VDD2 | 68.04,73.29 69.67,73.29 C23.1 | 68.04,73.29 67.67,73.29 | 68.04,73.29 68.04,70.42 | 68.04,70.42 U$8.VDD1 | 68.04,73.29 C24.1 67.67,73.29 | 63.92,68.42 63.67,68.67 C21.1 63.92,68.42 | 63.92,68.42 64.79,67.54 65.54,67.54 65.92,67.92 66.54,67.92 U$8.SDO_A/G | 65.42,69.29 64.79,69.29 64.67,69.17 | 65.42,69.29 65.54,69.29 65.92,68.92 66.54,68.92 U$8.VDDIO2 | 63.92,68.42 64.67,69.17 | R13.2 78.67,70.67 78.67,67.67 R12.2 78.17,67.67 77.17,66.67 70.17,66.67 | U$8.CS_A/G 67.67,66.92 67.92,66.92 U$8.CS_M 68.04,66.92 68.04,66.04 69.79,64.29 | U$9.POS 47.17,73.42 46.79,73.04 46.79,67.63 | 70.17,66.67 70.17,64.67 69.79,64.29 | 70.17,66.67 70.17,66.92 U$8.DEN_A/G 70.17,66.67 | 66.29,71.54 67.17,70.67 67.17,70.42 U$8.VDDIO | 69.79,64.29 v69.67,64.17 | 65.42,69.29 65.42,70.67 66.29,71.54 | 66.29,71.54 v66.17,71.67 | 67.67,73.29 67.17,73.29 66.42,74.04 64.92,74.04 64.67,73.79 64.67,69.17 | v94.67,65.67 95.54,64.79 J2.4 | v72.67,59.29 72.67,58.42 | v58.67,61.92 61.29,59.29 | 61.29,59.29 C12.1
  Top 0.457: v47.67,64.67 47.67,67.63 U$4.5 46.79,67.63 45.56,67.63 C3.2
  Bottom 0.152: v67.17,52.92 v65.42,52.92 | v72.67,59.29 72.67,61.17 v69.67,64.17 | v58.67,61.92 57.67,61.92 55.79,63.79 48.54,63.79 v47.67,64.67
  pour Route15: 41.67,69.67 55.67,69.67 55.67,75.67 41.67,75.67 41.67,98.67 95.67,98.67 95.67,42.67 76.67,42.67 76.67,45.67 61.67,45.67 61.67,42.67 41.67,42.67
BAT_GND  (via drill 0.38)
  Top 0.457: BATT1.- U$1.R 51.67,65.17 v51.67,64.67 51.54,65.04 50.29,63.79 49.67,63.79 C2.2 | C17.2 40.67,48.17 40.17,48.17 39.04,47.04 39.04,45.29 38.17,44.42 U$6.SRC 38.29,44.29 38.29,43.67 39.04,42.92 39.04,39.54 v38.67,39.67 | U$7.SRC 101.67,44.42 101.67,42.17 R11.1 101.42,42.17 98.92,39.67 v98.67,39.67 98.29,39.29 C20.2 | U$5.SRC 36.29,92.92 36.29,95.17 R7.1 36.42,95.29 36.42,95.92 38.17,97.67 v38.67,97.67 39.04,98.04 C16.2 | v38.67,39.67 38.67,39.79 36.29,42.17 R9.1 | v37.67,86.17 37.79,86.17 40.67,89.04 C15.2 | v100.67,51.67 100.04,51.67 96.67,48.29 96.17,48.29 C19.2 | v38.67,39.67 39.04,39.29 C18.2 | C4.2 97.29,98.04 v98.67,96.67 99.04,96.29 99.04,94.79 R2.1 U$2.SRC | v100.67,59.67 104.17,59.67 J2.2 | C1.2 98.38,89.06 98.56,88.89 100.17,88.89 v100.17,85.67
  other vias: 37.17,51.17
  pour Route2: 53.67,65.67 53.67,63.67 39.67,63.67 39.67,36.67 44.67,36.67 44.67,31.67 34.67,31.67 34.67,105.67 102.67,105.67 102.67,31.67 92.67,31.67 92.67,36.67 97.67,36.67 97.67,100.67 39.67,100.67 39.67,65.67
FILTERED1
  Top 0.457: R6.2 38.17,88.17 38.17,88.67 39.04,89.54 39.04,92.04 38.17,92.92 U$5.GND 38.17,93.04 38.17,95.17 R7.2
FILTERED2
  Top 0.457: R1.2 101.17,87.67 101.17,88.17 102.04,89.04 102.04,91.54 101.17,92.42 U$2.GND 101.17,92.54 101.17,94.67 R2.2
FILTERED3
  Top 0.457: R11.2 99.79,42.17 99.79,44.42 U$7.GND 99.54,44.67 95.79,44.67 95.29,45.17 95.29,46.42 95.79,46.92 96.54,46.92 99.29,49.67 R10.2
FILTERED4
  Top 0.457: R9.2 38.04,42.17 38.04,42.67 36.29,44.42 U$6.GND 36.04,44.54 35.29,45.29 35.29,47.79 35.54,48.04 36.67,48.04 37.79,49.17 R8.2
FLYBACK1
  Top 0.457: D1.A 41.17,93.29 39.04,95.42 39.04,95.92 38.67,96.29 37.67,96.29 37.17,95.79 U$5.DRN 37.04,91.67 35.54,91.67 33.04,94.17 33.04,101.04 35.04,103.04 37.04,103.04 MOTOR1.V-
FLYBACK2
  Top 0.457: MOTOR2.V- 100.17,98.34 U$2.DRN 99.27,91.19 98.56,91.19 98.24,91.5 D4.A
FLYBACK3
  Top 0.457: D5.A 96.17,45.92 100.04,45.92 U$7.DRN 100.79,46.42 101.54,46.42 104.29,43.67 104.29,36.79 102.29,34.79 100.29,34.79 MOTOR3.V-
FLYBACK4  (via drill 0.38)
  Top 0.457: v40.04,45.92 41.17,45.92 D6.A | U$6.DRN 39.42,48.79 v39.42,49.17 39.29,49.29 39.29,49.67 38.67,50.29 37.67,50.29 37.54,50.17 36.79,50.17 36.67,50.29 35.67,50.29 34.29,48.92 34.29,44.79 34.67,44.42 34.67,37.17 MOTOR4.V-
  Bottom 0.457: v40.04,45.92 40.04,48.54 v39.42,49.17
GND  (via drill 0.38)
  Top 0.152: U1.61 63.72,49.67 66.29,49.67 | v68.67,49.67 66.29,49.67 | v68.67,49.67 67.78,48.78 U1.7 | v68.67,49.67 69.78,48.56 U1.11 | U1.11 U1.10 | U1.20 73.34,49.67 70.92,49.67 | 70.92,49.67 v68.67,49.67 | U1.24 73.28,51.47 72.53,51.47 72.4,51.33 72.4,49.86 72.53,49.73 73.28,49.73 U1.20 | U$8.SDO_M v67.17,64.17 | U$8.GND1 U$8.GND2 U$8.RES1 70.45,70.67 v71.67,70.67 70.67,69.67 U$8.RES2 U$8.RES3 U$8.RES4 U$8.RES5 | U1.58 63.67,51.17 64.54,51.17 64.67,51.29 64.67,52.42 64.54,52.54 63.67,52.54 U1.55 63.54,52.67 62.79,52.67 61.67,53.79 61.67,54.54 59.29,56.92 59.29,57.17 | 59.29,57.17 59.29,59.17 C12.2 | 59.29,57.17 C11.2 58.92,57.17 56.17,54.42 C5.2 56.17,54.29 53.67,51.79 v53.67,51.67 53.67,51.54 56.17,49.04 C6.2 56.17,48.92 57.92,47.17 C8.2 | C21.2 63.67,73.29 65.42,75.04 65.67,75.04 C22.1 65.67,75.17 67.67,75.17 | 67.67,75.17 68.67,75.17 | 68.67,75.17 69.67,75.17 | 67.67,75.17 C24.2 | 69.67,75.17 71.67,75.17 C25.2 | 69.67,75.17 C23.2 | D3.C 87.42,49.67 88.17,48.92 89.92,48.92 90.67,49.67 D7.C 90.79,49.67 90.79,51.42 94.67,55.29 v94.67,56.67 95.17,57.17 J2.1 | C3.1 43.79,67.67 43.79,69.67 C14.2 43.67,69.67 43.67,72.67 | 71.54,55.67 71.29,55.92 71.29,56.67 U1.35 | 71.54,55.67 72.04,55.67 72.17,55.79 72.17,56.67 U1.33 | D2.C 77.54,104.67 87.67,94.54 J1.6 | 43.67,72.67 R15.1 | 43.67,72.67 v43.17,72.17 34.79,72.17 JP2.GND | C7.2 76.17,48.79 75.04,48.79 74.29,49.54 73.42,49.54 U1.20 | 66.29,49.67 66.29,56.67 U1.45 | 71.54,55.67 71.54,53.04 70.92,52.42 70.92,49.67 | 87.42,68.42 SW1.3 | 87.42,68.42 SW1.4 | 87.42,68.42 v87.67,68.67 | v42.67,53.67 34.79,53.67 JP1.GND | v68.67,76.67 68.67,75.17
  Top 0.152: C9.2 72.67,43.29 69.79,46.17 69.79,46.92 U1.11
  Top 0.457: v53.67,60.67 53.67,64.17 U$1.L 52.51,64.17 52.06,63.71 51.27,63.71 51.21,63.77 | U$4.2 50.69,68.87 51.15,68.87 51.38,69.09 51.38,71.38 v51.67,71.67
  other vias: 64.17,43.17 64.17,41.67 64.17,40.17 65.67,40.67 65.67,39.17 65.67,42.17 65.67,43.67 71.67,39.17 73.67,39.17 74.67,40.17 74.67,42.17 74.67,44.17
  pour Route2: 62.67,44.67 75.67,44.67 75.67,38.17 62.67,38.17
  pour Top: 62.67,44.67 75.67,44.67 75.67,38.17 62.67,38.17
  pour Route2: 61.67,42.67 61.67,45.67 76.67,45.67 76.67,42.67 95.67,42.67 95.67,98.67 41.67,98.67 41.67,67.67 55.67,67.67 55.67,61.67 41.67,61.67 41.67,42.67
MISO  (via drill 0.38)
  Top 0.152: v68.92,52.42 69.17,52.67 69.17,56.67 U1.39
  Bottom 0.152: v68.92,52.42 69.67,52.42 71.29,50.79 90.04,50.79 102.92,63.67 104.54,63.67 105.67,64.79 105.67,81.42 96.42,90.67 83.79,90.67 82.67,91.79 J1.1
MOSI  (via drill 0.38)
  Top 0.152: v69.79,51.04 69.79,56.67 U1.38 | v98.54,58.04 98.54,60.54 92.92,66.17 92.92,88.42 88.17,93.17 86.42,93.17 85.17,94.42 J1.4
  Bottom 0.152: v69.79,51.04 70.54,51.04 71.17,50.42 90.92,50.42 v98.54,58.04
N$1
  Top 0.152: U$4.4 47.92,69.42 47.92,68.79 48.67,68.04 48.67,64.42 48.04,63.79 47.29,63.79 44.79,66.29 44.79,68.92 45.54,69.67 C14.1
N$2
  Top 0.152: D7.A 88.67,49.67 88.67,52.67 R14.1
N$3
  Top 0.152: D2.A 71.04,104.67 70.04,105.67 68.79,105.67 67.79,104.67 R3.1
N$4
  Top 0.152: U1.56 58.67,52.1 58.52,52.1 | 58.52,52.1 Y2.3 | 58.52,52.1 56.17,52.1 C5.1
N$5
  Top 0.152: U1.57 61.17,51.6 60.82,51.6 | 60.82,51.6 Y2.1 | 60.82,51.6 56.17,51.6 C6.1
N$6
  Top 0.152: D3.A 84.17,49.67 84.17,52.67 R4.1
N$7
  Top 0.152: C7.1 76.17,50.67 73.42,50.67 U1.22 73.42,50.54 73.42,50.17 U1.21
N$8
  Top 0.152: U1.60 63.62,50.07 62.37,50.07 61.6,49.3 61.6,48.77 60.56,47.74 C8.1
N$9
  Top 0.152: U1.8 68.28,43.98 67.67,43.47 67.67,42.37 B1.4
N$10
  Top 0.152: U1.9 68.78,43.96 69.37,43.47 69.37,42.37 B1.3
N$11
  Top 0.152: C9.1 69.95,42.19 69.95,42.05 69.56,41.67 B1.2
N$12
  Top 0.457: C10.1 69.32,41.07 B1.1 68.67,40.37 U$3.FEED
N$13  (via drill 0.38)
  Top 0.152: v61.17,69.67 61.17,68.92 66.79,63.29 81.17,63.29 86.92,57.54 88.67,57.54 C13.1
  Bottom 0.152: v61.17,69.67 38.04,69.67 34.79,66.42 JP1.DTR
N$14
  cutout Route15: 65.67,71.67 65.67,65.67 71.67,65.67 71.67,71.67
N$17
  Top 0.457: BATT1.+ 54.06,72.67 J3.1
N$18
  Top 0.152: R15.2 43.67,77.67 47.04,77.67 47.17,77.79 U$9.NEG
N$20
  Top 0.152: U$8.CAP 68.92,70.42 68.92,71.17 70.17,72.42 70.92,72.42 71.67,73.17 C25.1
N$23
  Top 0.152: U$8.C1 67.54,70.42 67.54,71.54 65.92,73.17 65.67,73.17 C22.2
PB4  (via drill 0.38)
  Top 0.152: v87.92,55.29 90.54,52.67 R14.2 | v83.17,60.04 74.92,60.04 74.42,60.54 71.54,60.54 68.79,57.79 68.79,56.79 U1.40
  Bottom 0.152: v83.17,60.04 v87.92,55.29
PB5  (via drill 0.38)
  Top 0.152: 40.67,87.17 38.79,85.29 37.29,85.29 36.29,86.29 36.29,88.17 R6.1 | 67.17,62.42 42.42,87.17 40.67,87.17 | 67.17,62.42 68.29,61.29 68.29,56.79 U1.41 | 40.67,87.17 C15.1 | 67.17,62.42 v77.67,62.42
  Bottom 0.152: v77.67,62.42 77.79,62.54 82.79,62.54 95.17,74.92 104.17,74.92 J2.8
PB6  (via drill 0.38)
  Top 0.152: v85.17,53.79 86.04,52.92 86.04,52.67 R4.2 | v67.42,59.42 67.42,57.92 67.67,57.67 67.67,56.79 U1.42
  Bottom 0.152: v85.17,53.79 76.54,53.79 75.79,54.54 75.79,55.04 74.17,56.67 72.67,56.67 72.17,57.17 69.67,57.17 v67.42,59.42
PB7  (via drill 0.38)
  Top 0.152: v69.54,77.67 69.54,104.67 R3.2 | v63.42,61.42 67.17,57.67 67.17,56.79 U1.43
  Bottom 0.152: v69.54,77.67 69.54,76.29 63.42,70.17 v63.42,61.42
PE3  (via drill 0.38)
  Top 0.152: C1.1 96.67,87.29 97.04,87.67 R1.1 99.29,87.67 99.29,72.29 104.17,67.42 J2.5 | v63.42,56.54 63.54,56.42 63.54,55.67 U1.49
  Bottom 0.152: v63.42,56.54 63.42,55.04 64.67,53.79 66.29,53.79 66.79,54.29 68.29,54.29 71.42,51.17 87.92,51.17 104.17,67.42 J2.5
PE4  (via drill 0.38)
  Top 0.152: 101.29,52.29 101.04,52.54 98.54,52.54 96.17,50.17 C19.1 | 101.29,52.29 101.54,52.04 101.54,49.67 R10.1 | v65.17,55.04 63.67,55.04 U1.50 | 101.29,52.29 105.29,56.29 105.29,68.67 104.17,69.79 J2.6
  Bottom 0.152: v65.17,55.04 73.29,55.04 75.42,52.92 87.29,52.92 104.17,69.79 J2.6
PE5  (via drill 0.38)
  Top 0.152: R8.1 35.92,49.17 34.79,48.04 34.79,45.04 35.42,44.42 35.42,38.17 36.42,37.17 36.42,36.92 34.92,35.42 34.67,35.42 33.04,37.04 33.04,48.42 36.67,52.04 38.79,52.04 40.67,50.17 | 58.54,60.17 56.92,60.17 46.92,50.17 40.67,50.17 | 58.54,60.17 59.79,60.17 60.04,59.92 60.04,56.67 62.04,54.67 63.54,54.67 U1.51 | 40.67,50.17 C17.1 | 58.54,60.17 v58.54,60.54
  Bottom 0.152: J2.7 104.17,73.42 105.29,74.54 105.29,80.42 104.54,81.17 71.79,81.17 62.04,71.42 62.04,64.04 v58.54,60.54
RESET
  Top 0.152: U1.12 70.29,46.92 70.29,46.17 70.54,45.92 74.79,45.92 77.54,48.67 78.17,48.67 R5.1 78.17,48.79 78.92,48.79 86.29,56.17 89.42,56.17 90.67,57.42 C13.2 90.67,57.54 90.67,62.29 91.92,63.54 SW1.1 SW1.2 91.92,73.04 87.79,77.17 87.79,91.79 J1.5
RX0  (via drill 0.38)
  Top 0.152: v63.42,59.04 64.29,59.04 65.67,57.67 65.67,56.79 U1.46
  Bottom 0.152: v63.42,59.04 63.42,58.04 62.67,57.29 38.79,57.29 JP1.TXO
RX1  (via drill 0.38)
  Top 0.152: v73.29,57.54 75.79,55.04 75.79,54.29 74.67,53.17 73.42,53.17 U1.27 | v65.17,63.17 65.17,63.54 48.92,79.79 34.79,79.79 JP2.TXO
  Bottom 0.152: v73.29,57.54 70.79,57.54 v65.17,63.17
SCK
  Top 0.152: J1.3 85.17,79.29 89.54,74.92 89.54,56.79 89.29,56.54 77.92,56.54 74.29,60.17 72.29,60.17 70.29,58.17 70.29,56.79 U1.37
SCL  (via drill 0.38)
  Top 0.152: v80.42,74.29 76.79,70.67 R13.1 | v66.29,70.17 66.54,69.92 66.54,69.42 U$8.SCL/SPC | v71.79,52.04 73.29,52.04 U1.25
  Bottom 0.152: J2.10 104.17,79.92 97.17,79.92 91.54,74.29 v80.42,74.29 71.04,74.29 66.92,70.17 v66.29,70.17 65.67,70.17 64.29,68.79 64.29,54.67 64.79,54.17 65.54,54.17 66.04,54.67 68.42,54.67 71.04,52.04 v71.79,52.04
SDA  (via drill 0.38)
  Top 0.152: v77.79,69.29 76.79,68.29 76.79,67.67 R12.1 | v65.17,68.42 66.54,68.42 U$8.SDA/SDI/SDO | v76.79,54.79 74.67,52.67 73.42,52.67 U1.26
  Bottom 0.152: J2.9 104.17,77.42 95.17,77.42 87.04,69.29 v77.79,69.29 76.79,68.29 | v65.17,68.42 65.67,68.42 67.04,67.04 75.54,67.04 76.79,68.29 | 76.79,68.29 v76.79,54.79
TX0  (via drill 0.38)
  Top 0.152: v62.29,58.17 64.67,58.17 65.17,57.67 65.17,56.79 U1.47
  Bottom 0.152: v62.29,58.17 40.42,58.17 34.79,63.79 JP1.RXI
TX1  (via drill 0.38)
  Top 0.152: v74.92,54.67 74.92,54.29 74.29,53.67 73.42,53.67 U1.28 | v65.17,60.92 63.29,62.79 56.42,62.79 54.54,60.92 54.54,60.29 54.04,59.79 45.42,59.79 33.54,71.67 33.54,81.17 34.67,82.29 JP2.RXI
  Bottom 0.152: v74.92,54.67 74.17,54.67 72.04,56.79 68.79,56.79 65.17,60.42 v65.17,60.92
VBAT  (via drill 0.38)
  Top 0.457: C2.1 49.67,67.63 U$4.1 50.1,67.92 49.64,67.92 49.42,68.14 49.42,69.01 49.64,69.23 50.1,69.23 U$4.3 47.67,72.26 v47.67,72.67 49.1,74.1 J3.2 | 93.04,99.67 93.04,102.54 94.67,104.17 C4.1 | 93.04,99.67 93.04,96.79 94.92,94.92 96.17,94.92 D4.C | 93.04,37.67 93.04,34.79 94.67,33.17 C20.1 | 93.04,37.67 93.04,40.54 94.92,42.42 96.17,42.42 D5.C | 44.29,99.67 44.29,102.54 42.67,104.17 C16.1 | 44.29,99.67 44.29,96.79 42.42,94.92 41.17,94.92 D1.C | 44.29,37.67 44.29,34.79 42.67,33.17 C18.1 | 44.29,37.67 44.29,40.54 42.42,42.42 41.17,42.42 D6.C | MOTOR4.V+ 36.92,35.04 36.92,35.92 v38.67,37.67 44.29,37.67 | MOTOR1.V+ 35.04,100.92 37.42,100.92 v38.67,99.67 44.29,99.67 | MOTOR3.V+ 102.29,36.92 99.42,36.92 v98.67,37.67 93.04,37.67 | v98.67,98.67 99.54,99.54 | 99.54,99.54 99.92,99.92 99.92,102.29 MOTOR2.V+ | v100.67,62.67 101.04,62.29 104.17,62.29 J2.3 | 93.04,99.67 99.42,99.67 99.54,99.54
  pour Route15: 34.67,31.67 34.67,105.67 102.67,105.67 102.67,31.67 92.67,31.67 92.67,36.67 97.67,36.67 97.67,100.67 39.67,100.67 39.67,73.67 53.67,73.67 53.67,71.67 39.67,71.67 39.67,36.67 44.67,36.67 44.67,31.67